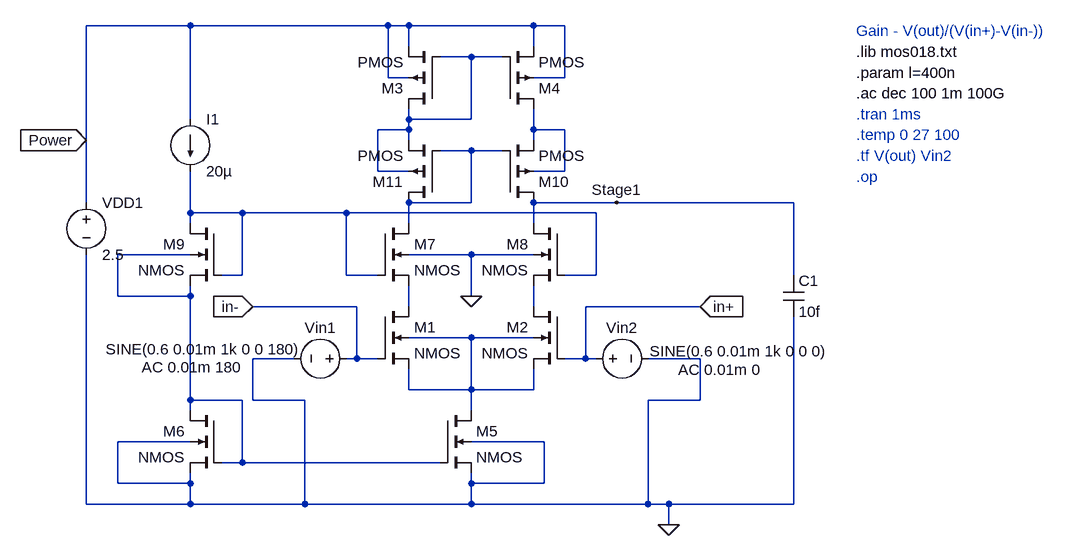
[diagram p0: schematic Stage 1.asc]
Stage 1.asc, the LTspice schematic file:
Version 4
SHEET 1 1444 680
WIRE -304 -224 -464 -224
WIRE 0 -224 -304 -224
WIRE 32 -224 0 -224
WIRE 224 -224 32 -224
WIRE 272 -224 224 -224
WIRE 32 -192 32 -224
WIRE 224 -192 224 -224
WIRE 128 -176 80 -176
WIRE 176 -176 128 -176
WIRE 0 -144 0 -224
WIRE 32 -144 0 -144
WIRE 272 -144 272 -224
WIRE 272 -144 224 -144
WIRE -304 -80 -304 -224
WIRE 32 -80 32 -96
WIRE 128 -80 128 -176
WIRE 128 -80 32 -80
WIRE 32 -64 32 -80
WIRE 32 -64 -16 -64
WIRE 224 -64 224 -96
WIRE 272 -64 224 -64
WIRE -464 -48 -464 -224
WIRE 32 -48 32 -64
WIRE 224 -48 224 -64
WIRE 128 -32 80 -32
WIRE 176 -32 128 -32
WIRE -16 0 -16 -64
WIRE 32 0 -16 0
WIRE 272 0 272 -64
WIRE 272 0 224 0
WIRE -464 48 -464 -48
WIRE 128 48 128 -32
WIRE 128 48 32 48
WIRE 352 48 224 48
WIRE 624 48 352 48
WIRE -304 64 -304 0
WIRE -224 64 -304 64
WIRE -64 64 -224 64
WIRE 320 64 -64 64
WIRE -304 80 -304 64
WIRE 32 80 32 48
WIRE 224 80 224 48
WIRE -304 128 -416 128
WIRE 128 128 32 128
WIRE 224 128 128 128
WIRE -224 160 -224 64
WIRE -224 160 -256 160
WIRE -64 160 -64 64
WIRE -16 160 -64 160
WIRE 320 160 320 64
WIRE 320 160 272 160
WIRE 624 160 624 48
WIRE -416 192 -416 128
WIRE -304 192 -304 176
WIRE -304 192 -416 192
WIRE 128 192 128 128
WIRE -48 208 -208 208
WIRE 32 208 32 176
WIRE 224 208 224 176
WIRE 480 208 304 208
WIRE 128 256 32 256
WIRE 224 256 128 256
WIRE -144 288 -208 288
WIRE -48 288 -48 208
WIRE -48 288 -64 288
WIRE -16 288 -48 288
WIRE 304 288 304 208
WIRE 304 288 272 288
WIRE 320 288 304 288
WIRE 480 288 400 288
WIRE 32 336 32 304
WIRE 128 336 128 256
WIRE 128 336 32 336
WIRE 224 336 224 304
WIRE 224 336 128 336
WIRE -304 352 -304 192
WIRE -224 352 -304 352
WIRE -208 352 -208 288
WIRE -128 352 -208 352
WIRE 480 352 480 288
WIRE 480 352 400 352
WIRE -304 368 -304 352
WIRE 128 368 128 336
WIRE -304 416 -416 416
WIRE 240 416 128 416
WIRE -224 448 -224 352
WIRE -224 448 -256 448
WIRE 80 448 -224 448
WIRE -416 480 -416 416
WIRE -304 480 -304 464
WIRE -304 480 -416 480
WIRE 128 480 128 464
WIRE 240 480 240 416
WIRE 240 480 128 480
WIRE -464 512 -464 128
WIRE -304 512 -304 480
WIRE -304 512 -464 512
WIRE -128 512 -128 352
WIRE -128 512 -304 512
WIRE 128 512 128 480
WIRE 128 512 -128 512
WIRE 400 512 400 352
WIRE 400 512 128 512
WIRE 432 512 400 512
WIRE 624 512 624 224
WIRE 624 512 432 512
WIRE 432 544 432 512
FLAG 432 544 0
FLAG 480 208 in+
IOPIN 480 208 In
FLAG -208 208 in-
IOPIN -208 208 In
FLAG 352 48 Stage1
FLAG -464 -48 Power
IOPIN -464 -48 In
FLAG 128 192 0
SYMBOL nmos4 -16 208 R0
SYMATTR InstName M1
SYMATTR Value2 l={l} w=500n m=1
SYMBOL nmos4 272 208 M0
SYMATTR InstName M2
SYMATTR Value2 l={l} w=0.5u m=1
SYMBOL pmos4 80 -96 R180
SYMATTR InstName M3
SYMATTR Value2 l={l} w=1u m=2
SYMBOL pmos4 176 -96 M180
SYMATTR InstName M4
SYMATTR Value2 l={l} w=1u m=2
SYMBOL nmos4 80 368 R0
SYMATTR InstName M5
SYMATTR Value2 l={l} w=2u
SYMBOL current -304 -80 R0
WINDOW 123 0 0 Left 0
WINDOW 39 0 0 Left 0
SYMATTR InstName I1
SYMATTR Value 20µ
SYMBOL nmos4 -256 368 M0
SYMATTR InstName M6
SYMATTR Value2 l={l} w=10u
SYMBOL voltage -464 32 R0
WINDOW 123 0 0 Left 0
WINDOW 39 0 0 Left 0
SYMATTR InstName VDD1
SYMATTR Value 2.5
SYMBOL voltage -48 288 R90
WINDOW 0 -32 56 VBottom 2
WINDOW 3 -30 236 VTop 2
WINDOW 123 -2 254 VTop 2
WINDOW 39 -2 236 VTop 2
SYMATTR InstName Vin1
SYMATTR Value SINE(0.6 0.01m 1k 0 0 180)
SYMATTR Value2 AC 0.01m 180
SYMBOL voltage 304 288 R270
WINDOW 0 32 56 VTop 2
WINDOW 3 27 235 VBottom 2
WINDOW 123 -2 206 VBottom 2
WINDOW 39 -1 235 VBottom 2
SYMATTR InstName Vin2
SYMATTR Value SINE(0.6 0.01m 1k 0 0 0)
SYMATTR Value2 AC 0.01m 0
SYMBOL nmos4 -256 80 M0
SYMATTR InstName M9
SYMATTR Value2 l={l} w=1u
SYMBOL pmos4 176 48 M180
SYMATTR InstName M10
SYMATTR Value2 l={l} w=400n m=1
SYMBOL pmos4 80 48 R180
SYMATTR InstName M11
SYMATTR Value2 l={l} w=400n m=1
SYMBOL cap 608 160 R0
SYMATTR InstName C1
SYMATTR Value 10f
SYMBOL nmos4 -16 80 R0
SYMATTR InstName M7
SYMATTR Value2 l={l} w=500n m=1
SYMBOL nmos4 272 80 M0
SYMATTR InstName M8
SYMATTR Value2 l={l} w=500n m=1
TEXT 720 -88 Left 2 ;.tran 1ms
TEXT 720 -56 Left 2 ;.temp 0 27 100
TEXT 720 -120 Left 2 !.ac dec 100 1m 100G
TEXT 720 -152 Left 2 !.param l=400n
TEXT 720 -184 Left 2 !.lib mos018.txt
TEXT 720 -216 Left 2 ;Gain - V(out)/(V(in+)-V(in-))
TEXT 720 8 Left 2 ;.op
TEXT 720 -24 Left 2 ;.tf V(out) Vin2

The netlist it stands for:
* Stage 1.asc
M1 N006 in- N008 N008 NMOS l={l} w=500n m=1
M2 N007 in+ N008 N008 NMOS l={l} w=0.5u m=1
M3 N001 N001 Power Power PMOS l={l} w=1u m=2
M4 N002 N001 Power Power PMOS l={l} w=1u m=2
M5 N008 N005 0 0 NMOS l={l} w=2u
I1 Power N004 20µ
M6 N005 N005 0 0 NMOS l={l} w=10u
VDD1 Power 0 2.5
Vin1 in- 0 SINE(0.6 0.01m 1k 0 0 180) AC 0.01m 180
Vin2 in+ 0 SINE(0.6 0.01m 1k 0 0 0) AC 0.01m 0
M9 N004 N004 N005 N005 NMOS l={l} w=1u
M10 Stage1 N003 N002 N002 PMOS l={l} w=400n m=1
M11 N003 N003 N001 N001 PMOS l={l} w=400n m=1
C1 Stage1 0 10f
M7 N003 N004 N006 0 NMOS l={l} w=500n m=1
M8 Stage1 N004 N007 0 NMOS l={l} w=500n m=1
.model NMOS NMOS
.model PMOS PMOS
.lib standard.mos
* .tran 1ms
* .temp 0 27 100
.ac dec 100 1m 100G
.param l=400n
.lib mos018.txt
* Gain - V(out)/(V(in+)-V(in-))
* .op
* .tf V(out) Vin2
.backanno
.end